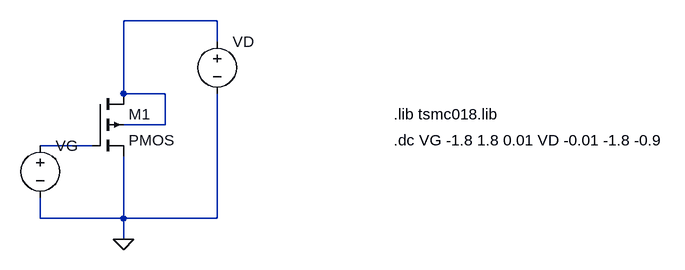
[diagram p0: schematic 180p_IDVG.asc]
180p_IDVG.asc, the LTspice schematic file:
Version 4
SHEET 1 1100 680
WIRE 384 16 240 16
WIRE 384 48 384 16
WIRE 240 128 240 16
WIRE 304 128 240 128
WIRE 304 176 304 128
WIRE 304 176 240 176
WIRE 192 208 112 208
WIRE 112 320 112 288
WIRE 240 320 240 224
WIRE 240 320 112 320
WIRE 384 320 384 128
WIRE 384 320 240 320
WIRE 240 352 240 320
FLAG 240 352 0
SYMBOL pmos4 192 128 R0
SYMATTR InstName M1
SYMATTR Value2 l=180n w=270n
SYMBOL voltage 112 192 R0
SYMATTR InstName VG
SYMATTR Value ""
SYMBOL voltage 384 32 R0
SYMATTR InstName VD
SYMATTR Value ""
TEXT 656 160 Left 2 !.lib tsmc018.lib
TEXT 656 200 Left 2 !.dc VG -1.8 1.8 0.01 VD -0.01 -1.8 -0.9

The netlist it stands for:
* 180p_IDVG.asc
M1 N001 N002 0 N001 PMOS l=180n w=270n
VG N002 0
VD N001 0
.model NMOS NMOS
.model PMOS PMOS
.lib standard.mos
.lib tsmc018.lib
.dc VG -1.8 1.8 0.01 VD -0.01 -1.8 -0.9
.backanno
.end